# EAGLE design DummyLoad (EAGLE 8.6.3)
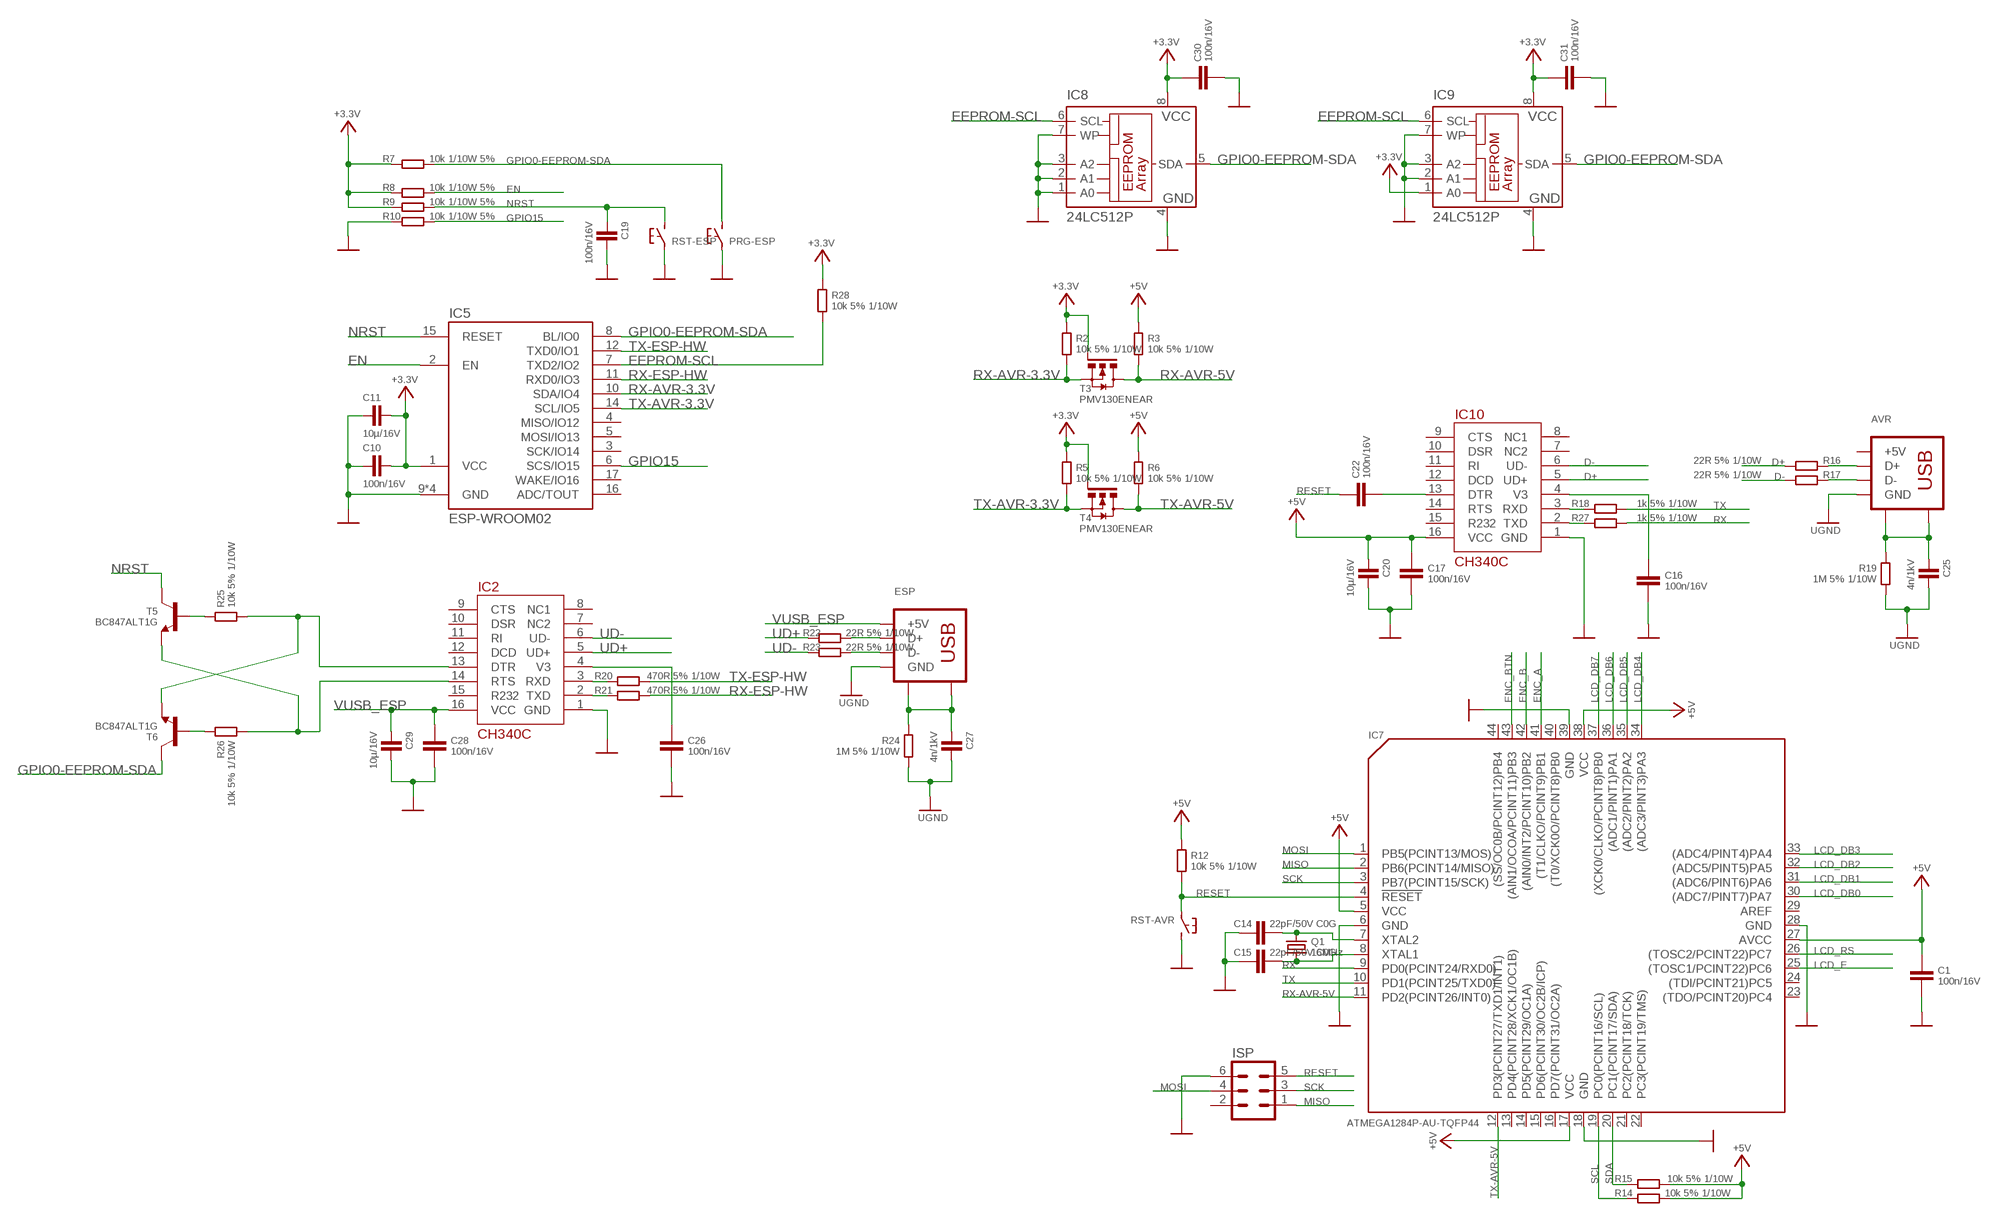
[diagram p0: schematic, sheet 1, part 1 of 2]
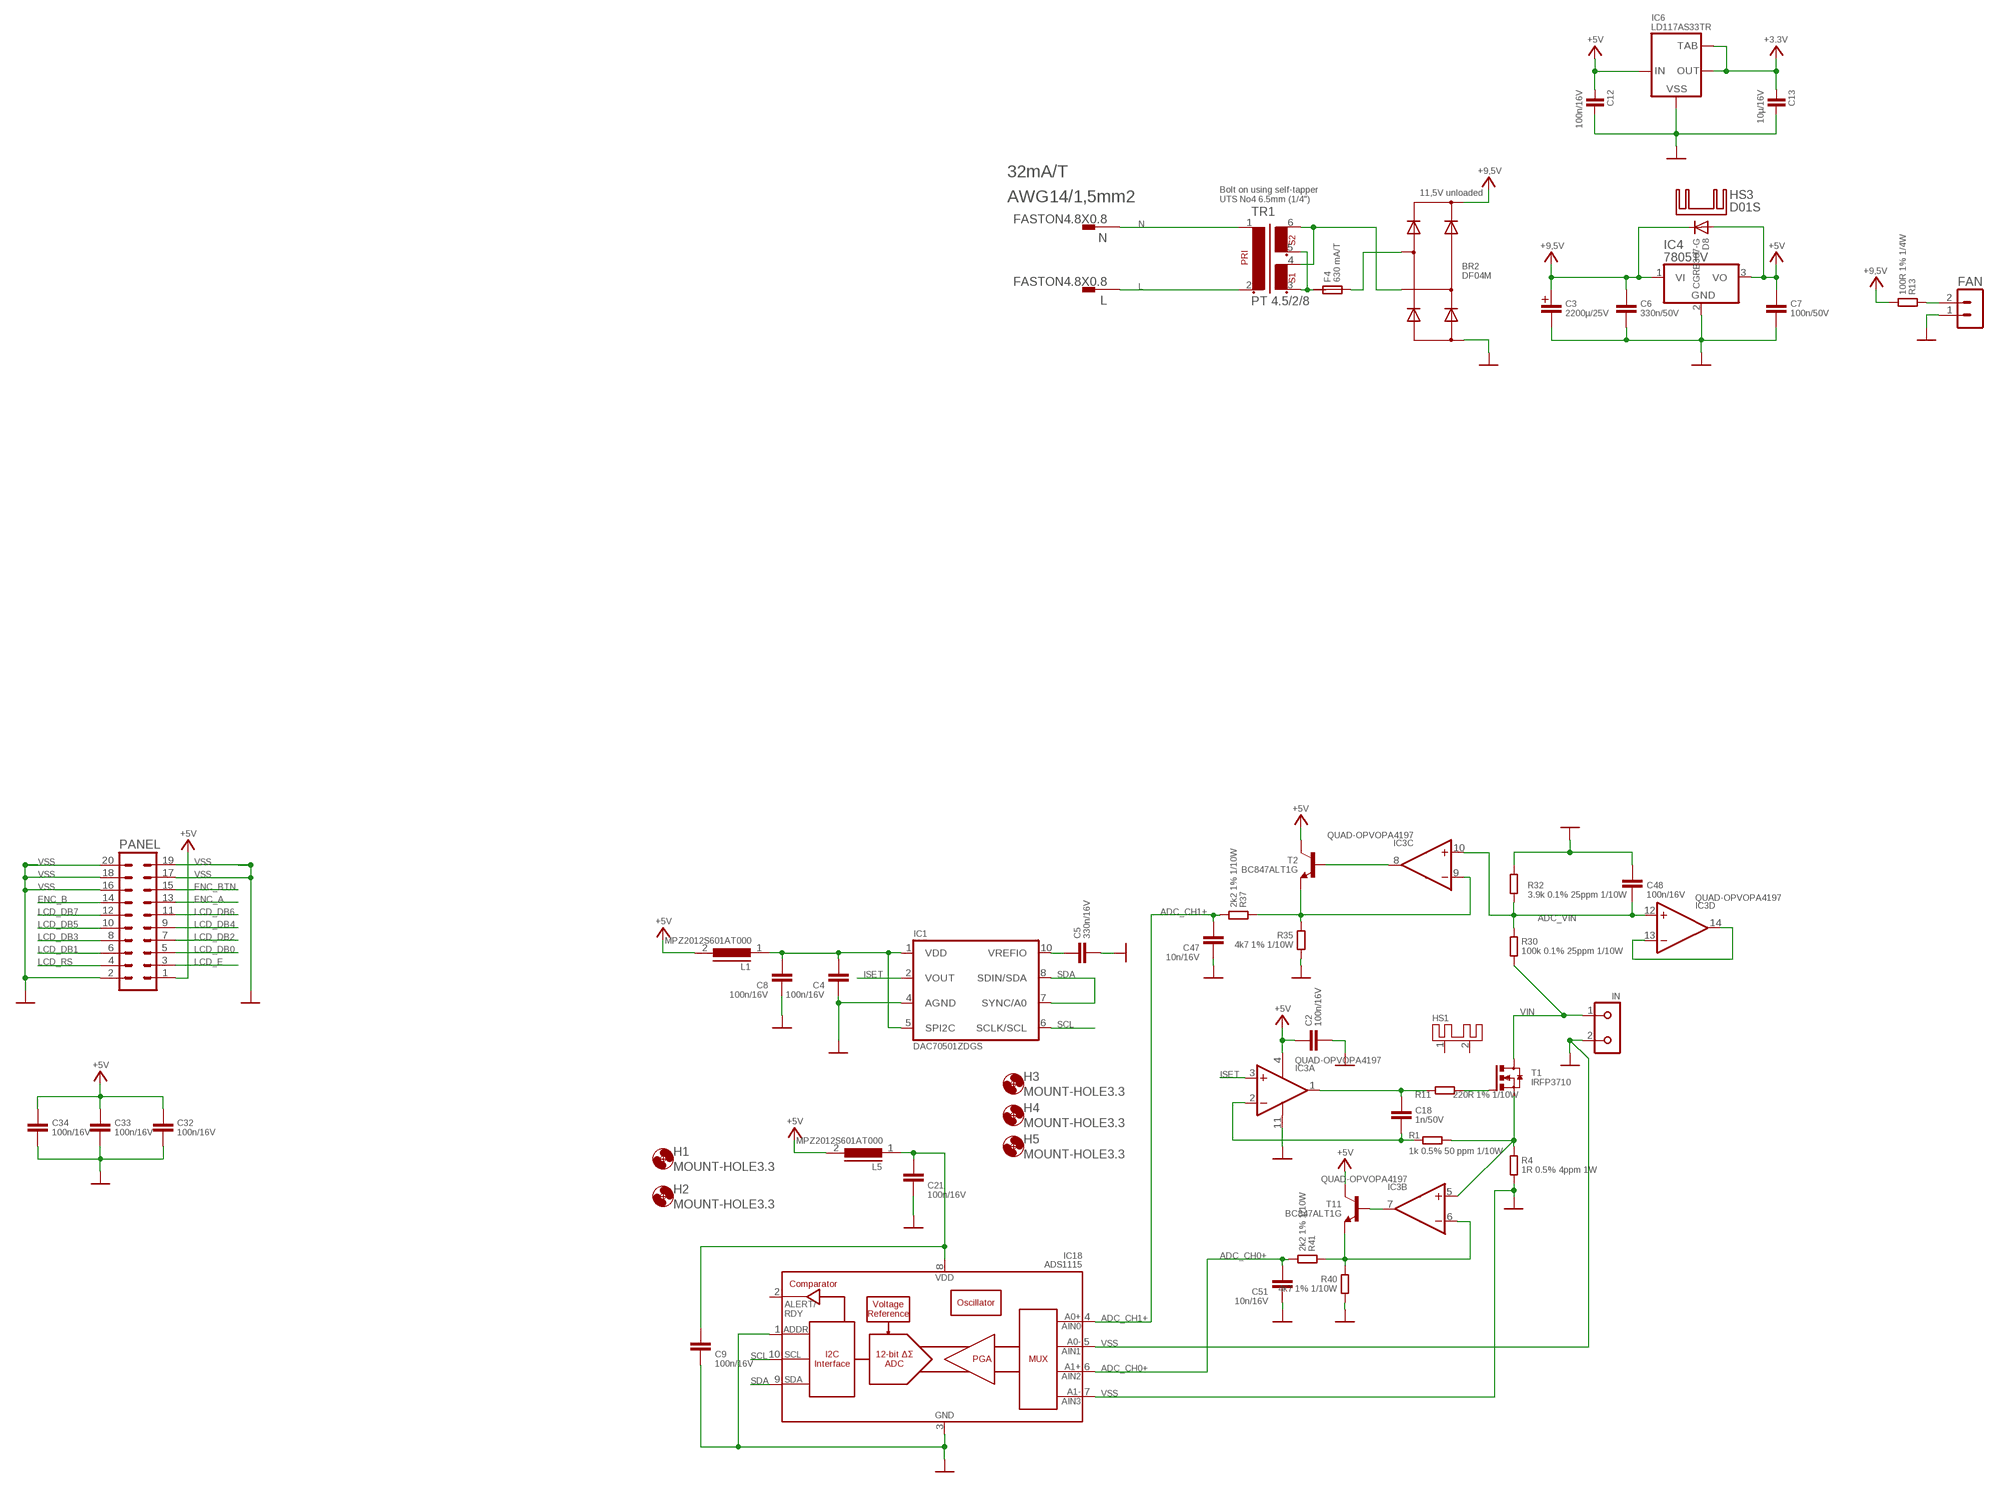
[diagram p1: schematic, sheet 1, part 2 of 2]

## Parts
AVR  USBUSB-B  [USB-B]
BR2  DF04M  BRDIL2  [BR-DIL2]
C1  100n/16V  CC/0805  [0805]
C2  100n/16V  CC/0805  [0805]
C3  2200µ/25V  C+5/12.5  [C+/5/12.5]
C4  100n/16V  CC/0805  [0805]
C5  330n/16V  CC/0805  [0805]
C6  330n/50V  CC/0805  [0805]
C7  100n/50V  CC/0805  [0805]
C8  100n/16V  CC/0805  [0805]
C9  100n/16V  CC/0805  [0805]
C10  100n/16V  CAPACITOR-0805  [C0805]
C11  10µ/16V  CAPACITOR-1210  [C1210]
C12  100n/16V  CAPACITOR-0805  [C0805]
C13  10µ/16V  CAPACITOR-1210  [C1210]
C14  22pF/50V C0G  CC/0805  [0805]
C15  22pF/50V C0G  CC/0805  [0805]
C16  100n/16V  CC/0805  [0805]
C17  100n/16V  CC/0805  [0805]
C18  1n/50V  CC/0805  [0805]
C19  100n/16V  CAPACITOR-0805  [C0805]
C20  10µ/16V  CAPACITOR-1210  [C1210]
C21  100n/16V  CC/0805  [0805]
C22  100n/16V  CC/0805  [0805]
C25  4n/1kV  CAPACITOR-1206  [C1206]
C26  100n/16V  CC/0805  [0805]
C27  4n/1kV  CAPACITOR-1206  [C1206]
C28  100n/16V  CC/0805  [0805]
C29  10µ/16V  CAPACITOR-1210  [C1210]
C30  100n/16V  CC/0805  [0805]
C31  100n/16V  CC/0805  [0805]
C32  100n/16V  CC/0805  [0805]
C33  100n/16V  CC/0805  [0805]
C34  100n/16V  CC/0805  [0805]
C47  10n/16V  CC/0805  [0805]
C48  100n/16V  CC/0805  [0805]
C51  10n/16V  CC/0805  [0805]
D8  CGRB307-G  DWIDE  [DO214AA-CGRB307-G]
ESP  USBUSB-B  [USB-B]
F4  630 mA/T  F5X20  [F5X20]
FAN  JST-PH-2.0-2P  [JST-PH-2.0-2P]
H1  MOUNT-HOLE3.3  [3,3]
H2  MOUNT-HOLE3.3  [3,3]
H3  MOUNT-HOLE3.3  [3,3]
H4  MOUNT-HOLE3.3  [3,3]
H5  MOUNT-HOLE3.3  [3,3]
HS1  HSCR201-50  [CR201-50]
HS3  D01S  [D01S]
IC1  DAC70501ZDGS  DAC70501  [VSSOP10]
IC2  CH340C  [SOP16]
IC3  QUAD-OPVOPA4197  [SO14]
IC4  7805TV  [TO220V]
IC5  ESP-WROOM02  [ESP-WROOM02]
IC6  LD117AS33TR  [SOT223]
IC7  ATMEGA1284P-AU-TQFP44  MCU-ATMEGA1284P-AU(TQFP44)  [TQFP44-0.8-9.6X9.6MM]
IC8  24LC512P  24P  [DIL08]
IC9  24LC512P  24P  [DIL08]
IC10  CH340C  [SOP16]
IC18  ADS1115  ADS1015VSSOP10  [VSSOP10]
IN  KL2691311500002  [KL2-691311500002]
ISP  ML6  [ML6]
L  FASTON4.8X0.8  [FASTON-4.8X0.8]
L1  MPZ2012S601AT000  L0805  [C0805K]
L5  MPZ2012S601AT000  L0805  [C0805K]
N  FASTON4.8X0.8  [FASTON-4.8X0.8]
PANEL  MA10-2  [MA10-2]
PRG-ESP  TS1B3F-10XX  [B3F-10XX]
Q1  16MHz  Q5X3.2MM-TXC-7A-SERIES  [Q-5X3.2MM-TXC-7A.SERIES]
R1  1k 0.5% 50 ppm 1/10W  R-SMD0805  [C0805K]
R2  10k 5% 1/10W  R-SMD0805  [C0805K]
R3  10k 5% 1/10W  R-SMD0805  [C0805K]
R4  1R 0.5% 4ppm 1W  R-SHUNTVSR  [R-SHUNT-VSR]
R5  10k 5% 1/10W  R-SMD0805  [C0805K]
R6  10k 5% 1/10W  R-SMD0805  [C0805K]
R7  10k 1/10W 5%  R-SMD0805  [C0805K]
R8  10k 1/10W 5%  R-SMD0805  [C0805K]
R9  10k 1/10W 5%  R-SMD0805  [C0805K]
R10  10k 1/10W 5%  R-SMD0805  [C0805K]
R11  220R 1% 1/10W  R-SMD0805  [C0805K]
R12  10k 5% 1/10W  R-SMD0805  [C0805K]
R13  100R 1% 1/4W  R-SMD0805  [C0805K]
R14  10k 5% 1/10W  R-SMD0805  [C0805K]
R15  10k 5% 1/10W  R-SMD0805  [C0805K]
R16  22R 5% 1/10W  R-SMD0805  [C0805K]
R17  22R 5% 1/10W  R-SMD0805  [C0805K]
R18  1k 5% 1/10W  R-SMD0805  [C0805K]
R19  1M 5% 1/10W  R-SMD0805  [C0805K]
R20  470R 5% 1/10W  R-SMD0805  [C0805K]
R21  470R 5% 1/10W  R-SMD0805  [C0805K]
R22  22R 5% 1/10W  R-SMD0805  [C0805K]
R23  22R 5% 1/10W  R-SMD0805  [C0805K]
R24  1M 5% 1/10W  R-SMD0805  [C0805K]
R25  10k 5% 1/10W  R-SMD0805  [C0805K]
R26  10k 5% 1/10W  R-SMD0805  [C0805K]
R27  1k 5% 1/10W  R-SMD0805  [C0805K]
R28  10k 5% 1/10W  R-SMD0805  [C0805K]
R30  100k 0.1% 25ppm 1/10W  R-SMD0805  [C0805K]
R32  3.9k 0.1% 25ppm 1/10W  R-SMD0805  [C0805K]
R35  4k7 1% 1/10W  R-SMD0805  [C0805K]
R37  2k2 1% 1/10W  R-SMD0805  [C0805K]
R40  4k7 1% 1/10W  R-SMD0805  [C0805K]
R41  2k2 1% 1/10W  R-SMD0805  [C0805K]
RST-AVR  TS1B3F-10XX  [B3F-10XX]
RST-ESP  TS1B3F-10XX  [B3F-10XX]
T1  IRFP3710  T-NMOSTO247  [TOP3AV]
T2  BC847ALT1G  T-NPNSOT23-BEC  [SOT23-BEC]
T3  PMV130ENEAR  T-NMOSIRLML2502PBF  [SOT23]
T4  PMV130ENEAR  T-NMOSIRLML2502PBF  [SOT23]
T5  BC847ALT1G  T-NPNSOT23-BEC  [SOT23-BEC]
T6  BC847ALT1G  T-NPNSOT23-BEC  [SOT23-BEC]
T11  BC847ALT1G  T-NPNSOT23-BEC  [SOT23-BEC]
TR1  PT 4.5/2/8  PT4,5/2/..  [PT/4,5/2/..]

## Nets
+3.3V: C10.2 C11.2 C13.1 C30.1 C31.1 IC5.1(VCC) IC6.2(OUT) IC6.4(OUT1) IC8.8(VCC) IC9.1(A0) IC9.8(VCC) R2.1 R5.1 R7.1 R8.1 R9.1 R28.1 T3.1(G) T4.1(G)
+5V: C1.1 C2.1 C7.1 C12.1 C17.1 C20.1 C32.1 C33.1 C34.1 D8.A IC3.4(PWR:V+) IC4.3(VO) IC6.3(IN) IC7.5(VCC) IC7.17(VCC) IC7.27(AVCC) IC7.38(VCC) IC10.16(VCC) L1.2 L5.2 PANEL.1 R3.1 R6.1 R12.1 R14.2 R15.2 T2.C T11.C
+9,5V: BR2.DC+ C3.+ C6.1 D8.C IC4.1(VI) R13.2
ADC_CH0+: C51.1 IC18.6(AIN2) R41.2
ADC_CH1+: C47.1 IC18.4(AIN0) R37.2
ADC_VIN: C48.2 IC3.10(C:+IN) IC3.12(D:+IN) R30.1 R32.2
D+: IC10.5(UD+) R16.1
D-: IC10.6(UD-) R17.1
EEPROM-SCL: IC5.7(TXD2/IO2) IC8.6(SCL) IC9.6(SCL) R28.2
EN: IC5.2(EN) R8.2
ENC_A: IC7.41((T1/CLKO/PCINT9)PB1) PANEL.13
ENC_B: IC7.42((AIN0/INT2/PCINT10)PB2) PANEL.14
ENC_BTN: IC7.43((AIN1/OCOA/PCINT11)PB3) PANEL.15
GPIO0-EEPROM-SDA: IC5.8(BL/IO0) IC8.5(SDA) IC9.5(SDA) PRG-ESP.3 R7.2 T6.C
GPIO15: IC5.6(SCS/IO15) R10.2
ISET: IC1.2(VOUT) IC3.3(A:+IN)
L: L.A1 L.A2 TR1.2
LCD_DB0: IC7.30((ADC7/PINT7)PA7) PANEL.5
LCD_DB1: IC7.31((ADC6/PINT6)PA6) PANEL.6
LCD_DB2: IC7.32((ADC5/PINT5)PA5) PANEL.7
LCD_DB3: IC7.33((ADC4/PINT4)PA4) PANEL.8
LCD_DB4: IC7.34((ADC3/PINT3)PA3) PANEL.9
LCD_DB5: IC7.35((ADC2/PINT2)PA2) PANEL.10
LCD_DB6: IC7.36((ADC1/PINT1)PA1) PANEL.11
LCD_DB7: IC7.37((XCK0/CLKO/PCINT8)PB0) PANEL.12
LCD_E: IC7.25((TOSC1/PCINT22)PC6) PANEL.3
LCD_RS: IC7.26((TOSC2/PCINT22)PC7) PANEL.4
MISO: IC7.2(PB6(PCINT14/MISO)) ISP.1
MOSI: IC7.1(PB5(PCINT13/MOS)) ISP.4
N: N.A1 N.A2 TR1.1
N$1: C18.1 IC3.1(A:OUT) R11.1
N$2: IC3.7(B:OUT) T11.B
N$3: C16.1 IC10.4(V3)
N$4: C18.2 IC3.2(A:-IN) R1.2
N$5: IC3.5(B:+IN) R1.1 R4.1 T1.E(S)
N$6: C9.1 C21.1 IC18.8(VDD) L5.1
N$7: C5.1 IC1.10(VREFIO)
N$8: IC3.8(C:OUT) T2.B
N$9: IC3.13(D:-IN) IC3.14(D:OUT)
N$10: AVR.D+ R16.2
N$11: AVR.D- R17.2
N$12: R11.2 T1.B(G)
N$13: IC10.3(RXD) R18.1
N$14: C14.2 IC7.7(XTAL2) Q1.2
N$15: C15.2 IC7.8(XTAL1) Q1.1
N$16: IC10.2(TXD) R27.1
N$17: AVR.SH1 AVR.SH2 C25.1 R19.1
N$18: C26.1 IC2.4(V3)
N$19: IC2.3(RXD) R20.1
N$20: IC2.2(TXD) R21.1
N$21: ESP.D+ R22.2
N$22: ESP.D- R23.2
N$23: C27.1 ESP.SH1 ESP.SH2 R24.1
N$24: R25.1 T5.B
N$25: R26.1 T6.B
N$26: C22.2 IC10.13(DTR)
N$27: BR2.AC1 F4.3 F4.4
N$28: IC2.14(RTS) R26.2 T5.E
N$29: IC2.13(DTR) R25.2 T6.E
N$33: F4.1 F4.2 TR1.3 TR1.5
N$34: BR2.AC2 TR1.4 TR1.6
N$35: FAN.2 R13.1
N$41: IC3.9(C:-IN) R35.1 R37.1 T2.E
N$45: IC3.6(B:-IN) R40.1 R41.1 T11.E
NRST: C19.1 IC5.15(RESET) R9.2 RST-ESP.3 T5.C
RESET: C22.1 IC7.4(!RESET) ISP.5 R12.2 RST-AVR.1
RX: IC7.9(PD0(PCINT24/RXD0)) R27.2
RX-AVR-3.3V: IC5.10(SDA/IO4) R2.2 T3.2(S)
RX-AVR-5V: IC7.11(PD2(PCINT26/INT0)) R3.2 T3.3(D)
RX-ESP-HW: IC5.11(RXD0/IO3) R21.2
SCK: IC7.3(PB7(PCINT15/SCK)) ISP.3
SCL: IC1.6(SCLK/SCL) IC7.19(PC0(PCINT16/SCL)) IC18.10(SCL) R14.1
SDA: IC1.7(SYNC/A0) IC1.8(SDIN/SDA) IC7.20(PC1(PCINT17/SDA)) IC18.9(SDA) R15.1
TX: IC7.10(PD1(PCINT25/TXD0)) R18.2
TX-AVR-3.3V: IC5.14(SCL/IO5) R5.2 T4.2(S)
TX-AVR-5V: IC7.12(PD3(PCINT27/TXD1/INT1)) R6.2 T4.3(D)
TX-ESP-HW: IC5.12(TXD0/IO1) R20.2
UD+: IC2.5(UD+) R22.1
UD-: IC2.6(UD-) R23.1
UGND: AVR.GND C25.2 C27.2 ESP.GND R19.2 R24.2
VDD: C4.1 C8.1 IC1.1(VDD) IC1.5(SPI2C) L1.1
VIN: IN.1 R30.2 T1.C(D)
VSS: BR2.DC- C1.2 C2.2 C3.- C4.2 C5.2 C6.2 C7.2 C8.2 C9.2 C10.1 C11.1 C12.2 C13.2 C14.1 C15.1 C16.2 C17.2 C19.2 C20.2 C21.2 C26.2 C28.2 C29.2 C30.2 C31.2 C32.2 C33.2 C34.2 C47.2 C48.1 C51.2 FAN.1 IC1.4(AGND) IC2.1(GND) IC3.11(PWR:V-) IC4.2(GND) IC5.9(GND) IC5.13(GND) IC5.18(GND) IC5.TP(GND) IC6.1(VSS) IC7.6(GND) IC7.18(GND) IC7.28(GND) IC7.39(GND) IC8.1(A0) IC8.2(A1) IC8.3(A2) IC8.4(GND) IC8.7(WP) IC9.2(A1) IC9.3(A2) IC9.4(GND) IC9.7(WP) IC10.1(GND) IC18.1(ADDR) IC18.3(VSS) IC18.5(AIN1) IC18.7(AIN3) IN.2 ISP.6 PANEL.2 PANEL.16 PANEL.17 PANEL.18 PANEL.19 PANEL.20 PRG-ESP.1 R4.2 R10.1 R32.1 R35.2 R40.2 RST-AVR.3 RST-ESP.1
VUSB_ESP: C28.1 C29.1 ESP.+5V IC2.16(VCC)
Unconnected: AVR.+5V HS1.1 HS1.2 IC2.7(NC2) IC2.8(NC1) IC2.9(CTS) IC2.10(DSR) IC2.11(RI) IC2.12(DCD) IC2.15(R232) IC5.3(SCK/IO14) IC5.4(MISO/IO12) IC5.5(MOSI/IO13) IC5.16(ADC/TOUT) IC5.17(WAKE/IO16) IC7.13(PD4(PCINT28/XCK1/OC1B)) IC7.14(PD5(PCINT29/OC1A)) IC7.15(PD6(PCINT30/OC2B/ICP)) IC7.16(PD7(PCINT31/OC2A)) IC7.21(PC2(PCINT18/TCK)) IC7.22(PC3(PCINT19/TMS)) IC7.23((TDO/PCINT20)PC4) IC7.24((TDI/PCINT21)PC5) IC7.29(AREF) IC7.40((T0/XCK0O/PCINT8)PB0) IC7.44((SS/OC0B/PCINT12)PB4) IC10.7(NC2) IC10.8(NC1) IC10.9(CTS) IC10.10(DSR) IC10.11(RI) IC10.12(DCD) IC10.14(RTS) IC10.15(R232) IC18.2(ALERT/RDY) ISP.2

## Notes on the sheet
- 32mA/T
- 11,5V unloaded
- AWG14/1,5mm2
- Bolt on using self-tapper
  UTS No4 6.5mm (1/4")

## Library data of the parts
AVR ESP = goujine-connectors:USB; OC_RS: 674-1328
BR2 = goujine:BR; OC_MOUSER: 621-DF04M; OC_MOUSER_ALT: 512-DF04M
C1 C2 C4 C7-C9 C16 C17 C21 C22 C26 C28 C30-C34 C48 = goujine:C: Kondensator; OC_MOUSER: 810-C2012X7R2A104K
C3 = neumluc:C+; OC_MOUSER: 667-EEU-FS1E222
C5 C6 = goujine:C: Kondensator; OC_MOUSER: 80-C0805C334K5RECTU
C10 C12 C19 = neumluc:CAPACITOR: Capacitors ...2.2uF @ 6.3V -> 0402 ...4.7uF @ 6.3V -> 0603 ...10uF @ 16V -> 0805 ...22uF @ 25V -> 1206; OC_MOUSER: 810-C2012X7R2A104K
C11 C13 C20 C29 = neumluc:CAPACITOR: Capacitors ...2.2uF @ 6.3V -> 0402 ...4.7uF @ 6.3V -> 0603 ...10uF @ 16V -> 0805 ...22uF @ 25V -> 1206; OC_MOUSER: 963-UMK316BBJ106KL-T
C14 C15 = goujine:C: Kondensator; OC_MOUSER: 603-CC805JRNPO9BN220
C18 = goujine:C: Kondensator; OC_MOUSER: 603-CC805KRX7R0BB102
C25 C27 = neumluc:CAPACITOR: Capacitors ...2.2uF @ 6.3V -> 0402 ...4.7uF @ 6.3V -> 0603 ...10uF @ 16V -> 0805 ...22uF @ 25V -> 1206; OC_MOUSER: 581-1206AC392K
C47 C51 = goujine:C: Kondensator; OC_MOUSER: 80-C0805C103K1R
D8 = neumluc:D; OC_MOUSER: 750-CGRB307-G
F4 = goujine:F: Sicherung; OC_MOUSER: 693-0751.0110
FAN = neumluc:JST-PH-2.0-2P: PIN HEADER; OC_DIGIKEY: 455-1704-ND; OC_MOUSER_ADD: 369-MF60251V21UA99
H1-H5 = holes:MOUNT-HOLE: MOUNTING HOLE with drill center marker
HS1 = neumluc:HS; OC_MOUSER: 588-CR201-50VE; OC_MOUSER_ADD: 588-CLA-TO-21E
HS3 = heatsink:D01S: HEATSINK distributor Schukat; OC_MOUSER: 532-576802B00
IC1 = neumluc:DAC70501; OC_MOUSER: 595-DAC70501ZDGS
IC2 IC10 = neumluc:CH340; OC_MOUSER: C84681
IC3 = neumluc:QUAD-OPV; OC_MOUSER: 595-OPA4197IDR
IC4 = linear:78*: Positive VOLTAGE REGULATOR Source: http://cache.national.com/ds/LM/LM78L05.pdf http://www.fairchildsemi.com/ds/LM/LM7805.pdf; OC_MOUSER: 511-L7805CV
IC5 = neumluc:ESP-WROOM02: Espressif ESP-WROOM-02 and AI-Thinker ESP-12 ESP8266 WiFi/WLAN Module; OC_MOUSER: 356-ESPWROOM02D(4MB)
IC6 = neumluc:LD117A?*: Low drop fixed and adjustable positive voltage regulators 1 A Source: http://www.st.com/stonline/products/literature/ds/7194/ld1117axx.pdf; OC_MOUSER: 511-LD1117AS33
IC7 = Seeed-OPL-ic:MCU-ATMEGA1284P-AU(TQFP44): 310010020; MPN: ATMEGA1284P-AU; OC_MOUSER: 556-ATMEGA1284P-AU
IC8 IC9 = neumluc:24*: Serial EEPROM I2C; OC_MOUSER: 579-24LC512-E/P
IC18 = neumluc:ADS1015: ADS1015 12-BIT ADC 12-Bit Del-Sig ADC Four single-ended inputs or two differential inputs Internal PGA I2C interface 2.0-5.5V SparkFun Products SparkFun Block for Intel Edison - ADC <https://www.sparkfun.com/products/13770> (DEV-13770); OC_MOUSER: 595-ADS1115IDGSR
IN = neumluc:KL2: Printklemme 2-polig; OC_MOUSER: 710-691311500002; OC_MOUSER_ADD: 565-72912-2; OC_MOUSER_ADD2: 565-6883
ISP = neumluc:ML6: HARTING; OC_FARNELL: unknown; OC_MOUSER: 200-TSW10307TD; OC_NEWARK: unknown
L N = neumluc:FASTON: Flachstecker Typ Tyco/Electronics/AMP TAB, FASTON Printed Circuit Board Tabs Source: http://www.buerklin.com, http://catalog.tycoelectronics.com; OC_CONRAD: 736079; OC_CONRAD_ADD: 1022092; OC_FARNELL: unknown; OC_NEWARK: unknown
L1 L5 = neumluc:L: High Power Density, High Efficiency, Shielded Inductors; OC_MOUSER: 810-MPZ2012S601AT000
PANEL = con-lstb:MA10-2: PIN HEADER; OC_FARNELL: unknown; OC_MOUSER: 649-67996-420HLF; OC_NEWARK: unknown
PRG-ESP RST-AVR RST-ESP = neumluc:TS1; OC_MOUSER: 653-B3F-1022
Q1 = neumluc:Q; OC_MOUSER: 717-7A-16.000MAAJ-T
R1 = neumluc:R-SMD: R SMD; OC_MOUSER: 754-RR1220P-102D
R2 R3 R5-R10 R12 R14 R15 R25 R26 R28 = neumluc:R-SMD: R SMD; OC_MOUSER: 652-CR0805-JW-103ELF
R4 = neumluc:R-SHUNT; OC_MOUSER: 71-VSRT1R0000DB
R11 R37 R41 = neumluc:R-SMD: R SMD; OC_MOUSER: 652-CR0805FX-2201ELF
R13 = neumluc:R-SMD: R SMD; OC_MOUSER: 660-RK73H2ATTD75R0F
R16 R17 R22 R23 = neumluc:R-SMD: R SMD; OC_MOUSER: 652-CR0805JW-220ELF
R18 R27 = neumluc:R-SMD: R SMD; OC_MOUSER: 652-CR0805FX-1001ELF
R19 R24 = neumluc:R-SMD: R SMD; OC_MOUSER: 652-CR0805JW-105ELF
R20 R21 = neumluc:R-SMD: R SMD; OC_MOUSER: 652-CR0805FX-4700ELF
R30 = neumluc:R-SMD: R SMD; OC_MOUSER: 754-RG2012P-104-B-T5
R32 = neumluc:R-SMD: R SMD; OC_MOUSER: 754-RG2012P-392-BT5
R35 R40 = neumluc:R-SMD: R SMD; OC_MOUSER: 652-CR0805FX-4701ELF
T1 = neumluc:T-NMOS: Transistor N-Channel MOSFET; OC_MOUSER: 942-IRFP3710PBF
T2 T5 T6 T11 = neumluc:T-NPN: NPN Transistor; OC_MOUSER: 863-BC847ALT1G
T3 T4 = neumluc:T-NMOS: Transistor N-Channel MOSFET; OC_MOUSER: 771-PMV130ENEAR
TR1 = neumluc:PT4,5/2/..: TRANSFORMER 1 primary winding, 1 secondary winding, mounting holes BLOCK; OC_RS: 201-8463; OC_RS_ADD: 546-5604

## Board
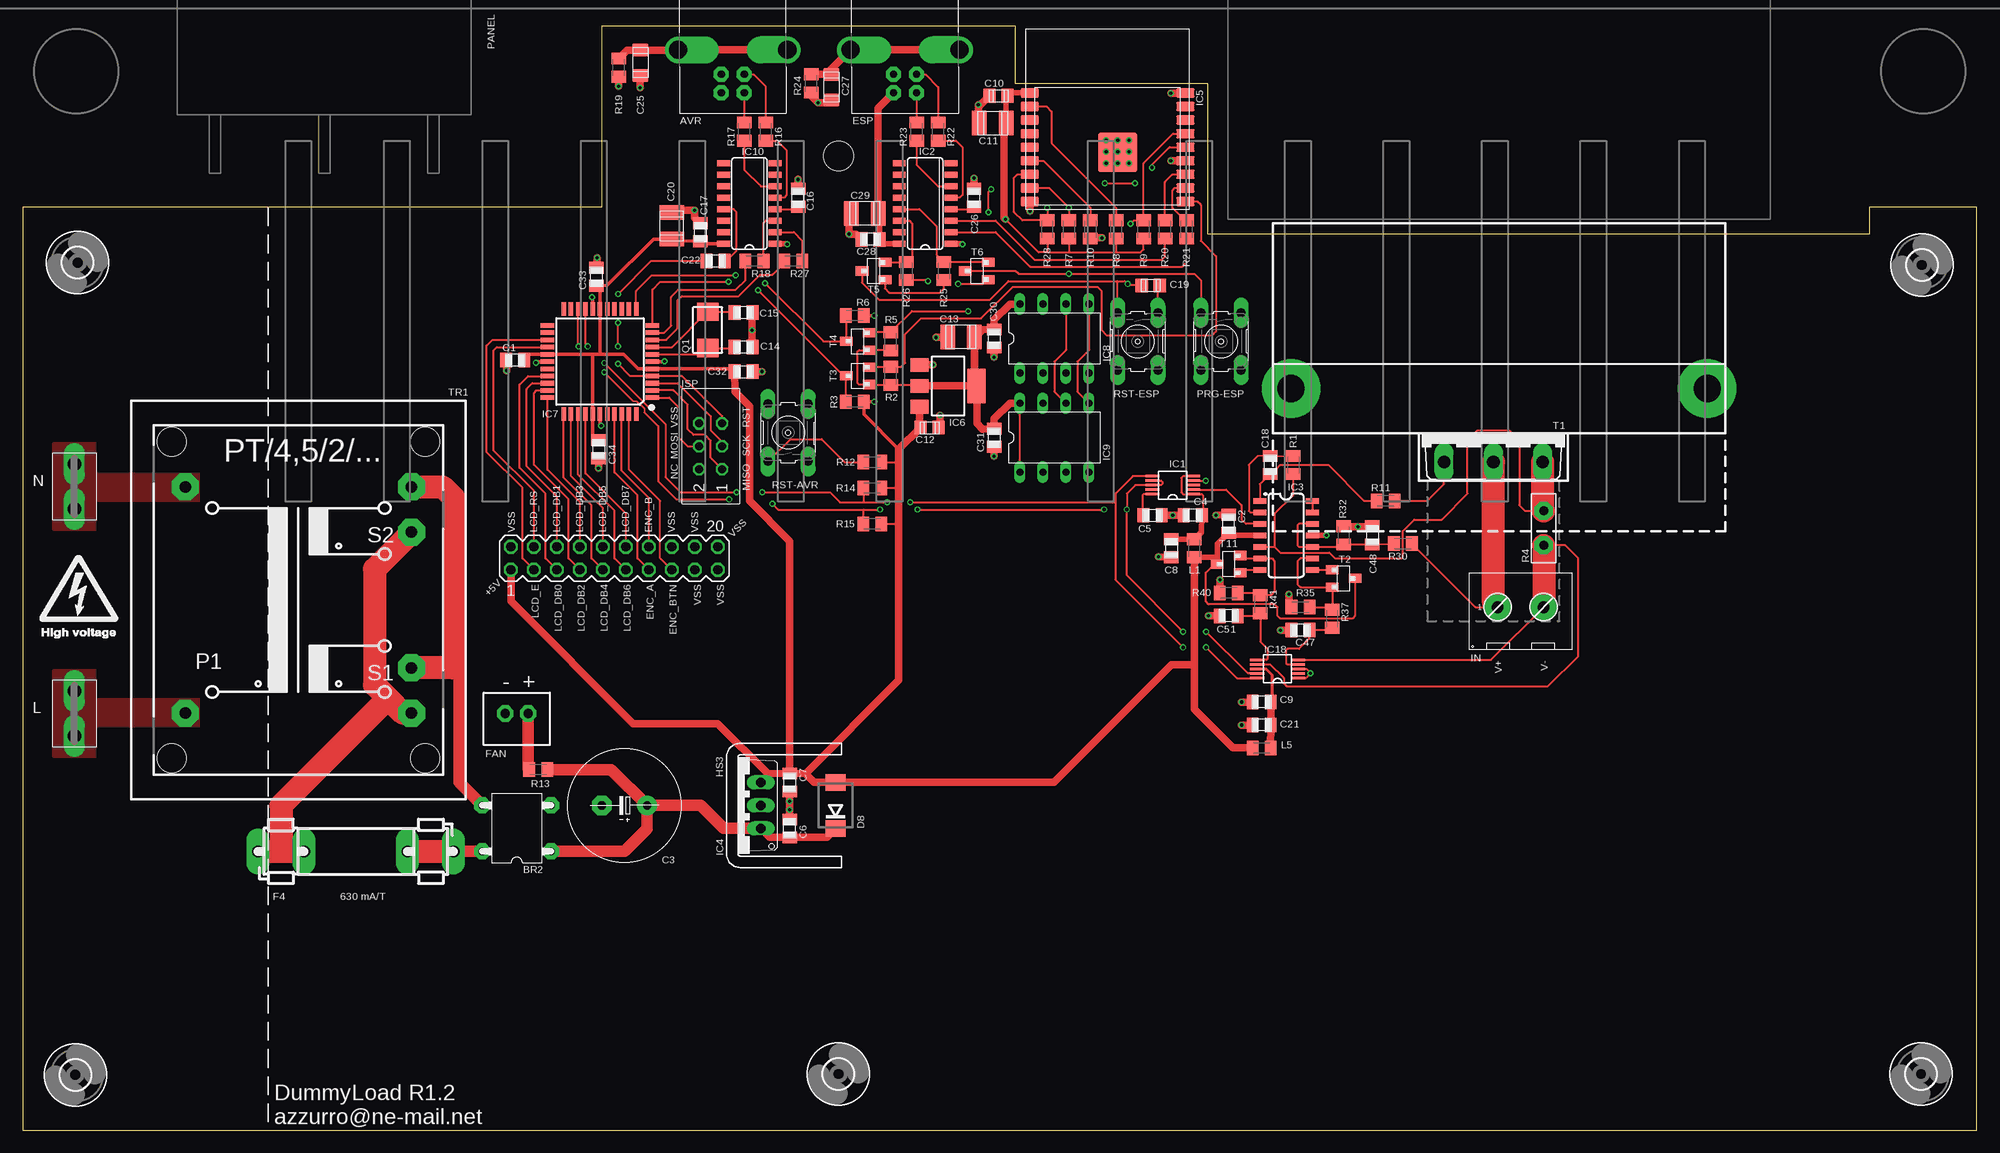
[diagram p2: board, top side]
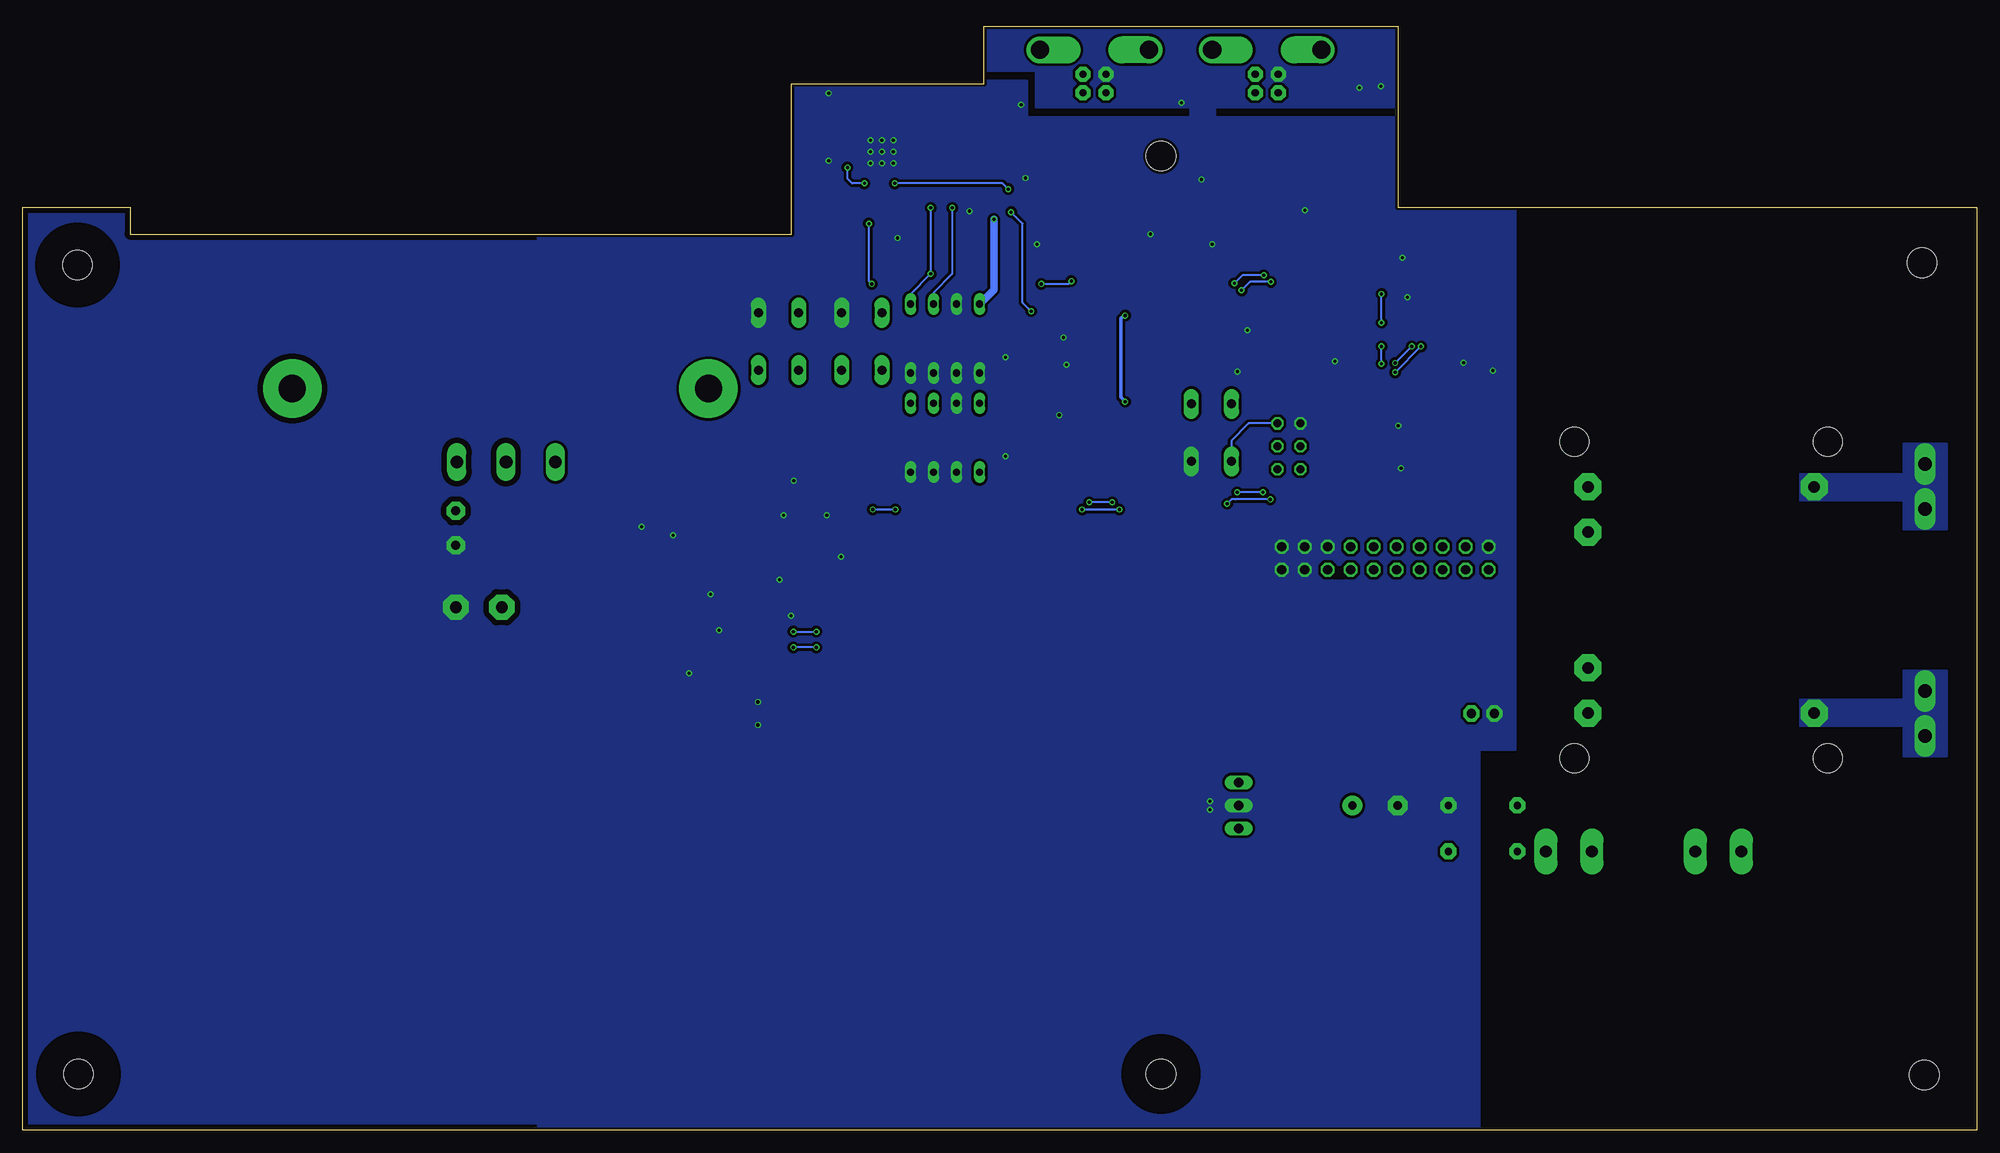
[diagram p3: board, bottom side, seen from below]

Size 216 x 122 mm. Coordinates in mm from the lower left corner, seen from the top.
Outline: 0,0 216,0 216,102 204.12,102 204.12,99 131,99 131,115.65 109.75,115.65 109.75,122 64,122 64,102 0,102 0,0
Copper layers (1*16): Top 0.035mm / dielectric 1.6mm / Bottom 0.035mm
Design rules "devnetX_JLCPCB_2-layer_PCB_eagle_rule": minimum track width 3.5mil, minimum drill 0.2mm, track to track 5mil, track to pad 5mil, pad to pad 5mil, via to via 5mil, smd to smd 0mil, copper to edge 8mil, drill to drill 10mil, minimum pad ring 3mil, minimum via ring 6mil, stop-mask expansion 0mil, vias tented up to drill 100mil, thermal gap 10mil
Holes 3.3 mm at 90.17,107.63
bRestrict: 4 lines

### Footprints (pad centres in the part's own frame; a part is rotated, then mirrored left to right if it is on the bottom)
USB-B = drill 0.8 pad 1.676 octagon: +5V 1.27,4.763; D+ -1.27,2.71; D- -1.27,4.763; GND 1.27,2.71 | drill 2 pad 2.54 offset: SH1 -6.032,0; SH2 6.032,0
BR-DIL2 = drill 0.8 pad 1.778 octagon: AC1 -2.54,3.81; AC2 2.54,3.81; DC+ -2.54,-3.81; DC- 2.54,-3.81
0805 = smd 1.3 x 1.6: 1 -1,0; 2 1,0
C+/5/12.5 = drill 0.9 pad 2.184: + -2.5,0 | drill 0.9 pad 2.184 octagon: - 2.5,0
C0805 = smd 1.5 x 1.35: 1 0,1; 2 0,-1
C1210 = smd 2.7 x 1.6: 1 0,1.475; 2 0,-1.475
C1206 = smd 1.8 x 1.45: 1 0,1.4; 2 0,-1.4
DO214AA-CGRB307-G = smd 1.8 x 2.2: A 2.55,0; C -2.55,0
F5X20 = drill 1.3 pad 2.54 long: 1 -11.43,0; 2 -6.35,0; 3 5.08,0; 4 10.16,0
JST-PH-2.0-2P = drill 1.016 pad 1.778 octagon: 1 -1.27,0; 2 1.27,0
3,3 = hole 3.3: 0,0
CR201-50 = drill 3 pad 6.452: 1 -23,-4.95; 2 23,-4.95
VSSOP10 = smd 0.3 x 1.55: 1 -1,-2.25; 2 -0.5,-2.25; 3 0,-2.25; 4 0.5,-2.25; 5 1,-2.25; 6 1,2.25; 7 0.5,2.25; 8 0,2.25; 9 -0.5,2.25; 10 -1,2.25
SOP16 = smd 0.635 x 1.422: 1 -4.445,-2.857; 2 -3.175,-2.857; 3 -1.905,-2.857; 4 -0.635,-2.857; 5 0.635,-2.857; 6 1.905,-2.857; 7 3.175,-2.857; 8 4.445,-2.857; 9 4.445,2.857; 10 3.175,2.857; 11 1.905,2.857; 12 0.635,2.857; 13 -0.635,2.857; 14 -1.905,2.857; 15 -3.175,2.857; 16 -4.445,2.857
SO14 = smd 0.6 x 1.4: 1 -3.81,-2.9; 2 -2.54,-2.9; 3 -1.27,-2.9; 4 0,-2.9; 5 1.27,-2.9; 6 2.54,-2.9; 7 3.81,-2.9; 8 3.81,2.9; 9 2.54,2.9; 10 1.27,2.9; 11 0,2.9; 12 -1.27,2.9; 13 -2.54,2.9; 14 -3.81,2.9
TO220V = drill 1.016 long: 1 -2.54,-2.54; 2 0,-2.54; 3 2.54,-2.54
ESP-WROOM02 = smd 2 x 1: 1 -8.6,1.9; 2 -8.6,0.4; 3 -8.6,-1.1; 4 -8.6,-2.6; 5 -8.6,-4.1; 6 -8.6,-5.6; 7 -8.6,-7.1; 8 -8.6,-8.6; 9 -8.6,-10.1; 10 8.6,-10.1; 11 8.6,-8.6; 12 8.6,-7.1; 13 8.6,-5.6; 14 8.6,-4.1; 15 8.6,-2.6; 16 8.6,-1.1; 17 8.6,0.4; 18 8.6,1.9 | smd 4.3 x 4.3: TP 1.12,-4.68
SOT223 = smd 1.5 x 2: 1 -2.3,-3.15; 2 0,-3.15; 3 2.3,-3.15 | smd 3.8 x 2: 4 0,3.15
TQFP44-0.8-9.6X9.6MM = smd 1.5 x 0.5: 1 -5.8,4; 2 -5.8,3.2; 3 -5.8,2.4; 4 -5.8,1.6; 5 -5.8,0.8; 6 -5.8,0; 7 -5.8,-0.8; 8 -5.8,-1.6; 9 -5.8,-2.4; 10 -5.8,-3.2; 11 -5.8,-4; 23 5.8,-4; 24 5.8,-3.2; 25 5.8,-2.4; 26 5.8,-1.6; 27 5.8,-0.8; 28 5.8,0; 29 5.8,0.8; 30 5.8,1.6; 31 5.8,2.4; 32 5.8,3.2; 33 5.8,4 | smd 0.5 x 1.5: 12 -4,-5.8; 13 -3.2,-5.8; 14 -2.4,-5.8; 15 -1.6,-5.8; 16 -0.8,-5.8; 17 0,-5.8; 18 0.8,-5.8; 19 1.6,-5.8; 20 2.4,-5.8; 21 3.2,-5.8; 22 4,-5.8; 34 4,5.8; 35 3.2,5.8; 36 2.4,5.8; 37 1.6,5.8; 38 0.8,5.8; 39 0,5.8; 40 -0.8,5.8; 41 -1.6,5.8; 42 -2.4,5.8; 43 -3.2,5.8; 44 -4,5.8
DIL08 = drill 0.8 long: 1 -3.81,-3.81; 2 -1.27,-3.81; 3 1.27,-3.81; 4 3.81,-3.81; 5 3.81,3.81; 6 1.27,3.81; 7 -1.27,3.81; 8 -3.81,3.81
KL2-691311500002 = drill 1.3 pad 2.8 octagon: 1 -2.54,0; 2 2.54,0
ML6 = drill 0.914 octagon: 1 -2.54,-1.27; 2 -2.54,1.27; 3 0,-1.27; 4 0,1.27; 5 2.54,-1.27; 6 2.54,1.27
FASTON-4.8X0.8 = drill 1.5 pad 2.3 long: A1 -2.5,0; A2 2.5,0
C0805K = smd 1.3 x 1.6: 1 -1,0; 2 1,0
MA10-2 = drill 1.016 octagon: 1 -11.43,-1.27; 2 -11.43,1.27; 3 -8.89,-1.27; 4 -8.89,1.27; 5 -6.35,-1.27; 6 -6.35,1.27; 7 -3.81,-1.27; 8 -3.81,1.27; 9 -1.27,-1.27; 10 -1.27,1.27; 11 1.27,-1.27; 12 1.27,1.27; 13 3.81,-1.27; 14 3.81,1.27; 15 6.35,-1.27; 16 6.35,1.27; 17 8.89,-1.27; 18 8.89,1.27; 19 11.43,-1.27; 20 11.43,1.27
B3F-10XX = drill 1 pad 1.676 long: 1 -3.175,1.905; 2 3.175,1.905; 3 -3.175,-2.54; 4 3.175,-2.54
Q-5X3.2MM-TXC-7A.SERIES = smd 2 x 2.4: 1 -2,0; 2 2,0
R-SHUNT-VSR = drill 1 pad 2 octagon: 1 -1.905,0; 2 1.905,0
TOP3AV = drill 1.397 long: B -5.461,-3.175; C 0,-3.175; E 5.461,-3.175
SOT23-BEC = smd 1 x 1.4: B -0.953,-1.27; C 0,1.27; E 0.953,-1.27
SOT23 = smd 1 x 1.4: 1 -0.953,-1.27; 2 0.953,-1.27; 3 0,1.27
PT/4,5/2/.. = drill 1.27 pad 3 octagon: 1 -12.5,12.5; 2 -12.5,-12.5; 3 12.5,-12.5; 4 12.5,-7.5; 5 12.5,7.5; 6 12.5,12.5 | hole 3.2: -14,17.5; -14,-17.5; 14,-17.5; 14,17.5

### Placement (x,y rotation side)
AVR  78.48,119.38 180 top
BR2  54.61,33.34 90 top
C1  54.45,85.09 180 top
C2  133.31,66.99 90 top
C3  66.52,35.88 180 top
C4  129.34,67.94 180 top
C5  124.89,67.94 0 top
C6  84.77,33.34 90 top
C7  84.77,38.42 270 top
C8  126.96,64.29 270 top
C9  136.96,47.31 180 top
C10  107.85,114.3 90 top
C11  107.22,111.28 90 top
C12  100.23,77.63 90 top
C13  103.73,87.63 270 top
C14  79.69,86.52 180 top
C15  79.69,90.33 180 top
C16  85.72,103.03 90 top
C17  74.93,99.22 90 top
C18  137.91,73.5 90 top
C19  124.68,93.34 90 top
C20  71.75,99.93 180 top
C21  136.96,44.77 180 top
C22  76.6,96.04 0 top
C25  68.26,117.95 0 top
C26  105.16,103.03 90 top
C27  89.38,115.25 0 top
C28  93.72,98.42 180 top
C29  93.09,101.28 270 top
C30  107.38,87.47 270 top
C31  107.38,76.52 270 top
C32  79.69,83.82 0 top
C33  63.42,94.3 90 top
C34  63.66,75.25 270 top
C47  141.24,55.24 180 top
C48  149.18,65.72 270 top
C51  133.31,56.83 180 top
D8  89.85,35.88 90 top
ESP  97.53,119.38 180 top
F4  37.46,30.8 0 top
FAN  54.61,46.04 0 top
H1  6.08,95.85 0 top
H2  5.83,6.1 0 top
H3  90.17,6.2 0 top
H4  209.82,6.2 0 top
H5  209.93,95.6 0 top
HS1  163.19,76.99 180 top
HS3  79.06,35.88 270 top
IC1  127.11,71.28 90 top
IC2  99.76,102.39 90 top
IC3  139.66,65.72 270 top
IC4  79.06,35.88 90 top
IC5  119.92,112.71 0 top
IC6  102.3,82.23 270 top
IC7  63.82,84.93 180 top
IC8  114.05,87.47 0 top
IC9  114.05,76.52 0 top
IC10  80.33,102.39 90 top
IC18  138.7,50.96 90 top
IN  165.58,57.78 0 top
ISP  76.04,75.57 90 top
L  5.71,46.04 90 top
L1  129.5,64.29 270 top
L5  136.96,42.23 180 top
N  5.71,71.12 90 top
PANEL  65.41,63.18 0 top
PRG-ESP  132.78,87.15 270 top
Q1  75.72,88.42 270 top
R1  140.45,73.5 90 top
R2  95.95,83.34 90 top
R3  91.98,80.49 180 top
R4  168.12,66.52 270 top
R5  95.95,87.15 90 top
R6  91.98,90.01 180 top
R7  115.63,99.54 90 top
R8  120.87,99.54 90 top
R9  123.89,99.54 90 top
R10  118.01,99.54 90 top
R11  150.65,69.53 0 top
R12  93.92,73.82 180 top
R13  56.99,39.85 0 top
R14  93.92,70.96 0 top
R15  93.92,66.99 0 top
R16  82.14,110.33 90 top
R17  79.75,110.33 90 top
R18  80.88,96.04 180 top
R19  65.88,117.41 270 top
R20  126.27,99.54 90 top
R21  128.65,99.54 90 top
R22  101.19,110.33 90 top
R23  98.81,110.33 90 top
R24  87.15,115.67 270 top
R25  101.82,94.93 90 top
R26  97.69,94.93 90 top
R27  85.17,96.04 180 top
R28  113.25,99.54 90 top
R30  152.56,64.81 0 top
R32  146.01,65.72 270 top
R35  141.24,57.78 180 top
R37  144.74,56.52 270 top
R40  133.31,59.37 180 top
R41  136.8,58.1 270 top
RST-AVR  84.3,77.07 90 top
RST-ESP  123.57,87.15 270 top
T1  162.56,76.99 0 top
T2  146.01,60.96 270 top
T3  92.3,83.34 90 top
T4  92.3,87.15 90 top
T5  94.04,94.93 90 top
T6  105.47,94.93 90 top
T11  133.31,62.55 90 top
TR1  30.48,58.58 0 top
U$1  [CASE-Z17]  108,26 0 top
U$2  [IEC-C14-FUSED-6200.2200]  33.34,129.18 0 top  (outside the outline)
U$3  [FAN60X25]  163.19,113.14 0 top
U$4  [SWITCH-ROCKER-1858.1103]  22.54,-77.36 180 top  (outside the outline)

### Tracks (layer width: path | path; a pad name or v marks a point on that pad's centre or on a via)
+3.3V  (via drill 0.35)
  Top 0.203: 113.25,97 112.3,97 v108.65,100.65 | 113.25,97 115.63,97 | 115.63,97 120.87,97 | 120.87,97 123.57,97 123.89,97.31 R9.1 | R28.1 113.25,97 | R7.1 115.63,97 | R8.1 120.87,97 | IC9.1 IC9.8 | R5.1 93.61,86.15 T4.1 92.45,86.2 92.3,86.04 92.3,82.55 92.45,82.39 T3.1 95.9,82.39 R2.1 99.04,82.34 IC6.2 | 104.95,82.23 105.2,82.48 | C13.1 105.36,87.79 105.47,87.79
  Top 0.61: IC5.1 109.17,114.61 C10.2 108.69,114.14 C11.2
  Top 0.813: v108.65,100.65 108.49,100.81 108.49,111.08 C11.2 | IC8.8 109.12,91.28 107.38,89.53 C30.1 106.11,88.42 105.47,87.79 | IC9.8 109.12,80.33 107.38,78.58 C31.1 106.11,77.47 105.47,78.11 105.47,82.21 IC6.4 | C13.1 105.2,82.48 IC6.4 | IC6.2 IC6.4
  Bottom 0.813: IC8.8 108.65,92.87 v108.65,100.65
+5V  (via drill 0.35)
  Top 0.203: 133.58,65.72 C2.1 | T2.C 147.28,56.83 146.96,56.52 139.02,56.52 138.7,56.83 138.7,57.78 138.39,58.1 131.08,58.1 130.77,58.42 130.77,61.59 131.72,62.55 T11.C | 92.87,80.38 R3.1 | C33.1 63.82,92.95 | R14.2 96.84,70.96 | R15.2 96.84,66.99 | R12.1 96.84,73.82
  Top 0.406: 63.82,92.95 IC7.17 63.82,85.73 | 63.02,85.73 IC7.27 56.05,85.73 C1.1 | 63.02,85.73 63.82,85.73 | 63.82,85.73 66.43,85.73 68.03,84.13 IC7.5 78.43,84.13 C32.1 | 63.02,85.73 63.02,85.72 IC7.38 63.02,76.84 C34.1 | 96.84,75.23 92.98,79.09 R3.1 v94.14,80.49 | IC10.16 75.25,97.95 C17.1 71.95,98.27 C20.1 69.72,98.46 64.61,93.34 C33.1 | v94.14,90.01 R6.1
  Top 0.61: IC3.4 133.58,65.72 | C2.1 132.04,64.77 132.04,63.34 | 132.04,63.34 T11.C | L1.2 131.99,63.29 132.04,63.34
  Top 0.813: L1.2 129.5,51.44 | 129.5,51.44 129.5,46.51 133.78,42.23 L5.2 | IC6.3 99.15,77.72 C12.1 96.84,75.23 96.84,73.82 96.84,70.96 96.84,66.99 96.84,49.69 86.52,39.37 | 129.5,51.44 127,51.44 113.99,38.43 D8.A 87.46,38.43 86.52,39.37 | IC4.3 82.55,39.37 | 82.55,39.37 C7.1 | C7.1 86.52,39.37 | PANEL.1 53.98,58.42 67.47,44.93 76.83,44.93 82.39,39.37 82.55,39.37 | C32.1 78.74,81.6 80.33,80.01 80.33,69.53 84.77,65.09 C7.1
  Bottom 0.406: v94.14,80.49 94.61,80.96 94.61,89.69 94.3,90.01 v94.14,90.01
+9,5V
  Top 0.813: IC4.1 82.55,32.38 C6.1 88.91,32.38 D8.C
  Top 1.27: BR2.DC+ 66.52,30.8 69.02,33.3 C3.+ | R13.2 65.05,39.85 C3.+ | C3.+ 74.93,35.88 77.47,33.34 IC4.1
ADC_CH0+
  Top 0.203: C51.1 136.53,56.83 R41.2 136.8,53.98 137.59,53.18 137.59,52.07 137.48,51.96 IC18.6
ADC_CH1+
  Top 0.203: IC18.4 139.79,51.46 139.66,51.59 139.66,53.02 139.81,53.18 141.09,53.18 142.2,54.29 C47.1 144.47,55.24 R37.2
ADC_VIN
  Top 0.203: IC3.12 141.09,66.99 140.93,66.83 140.93,64.61 141.09,64.45 IC3.10 145.74,64.45 R32.2 C48.2 151.51,64.77 R30.1
D+
  Top 0.203: R16.1 83.39,109.33 84.45,108.27 84.45,103.35 84.14,103.03 IC10.5
D-
  Top 0.203: R17.1 79.75,106.14 81.6,104.3 IC10.6
EEPROM-SCL  (via drill 0.35)
  Top 0.203: v113.25,101.92 R28.2 110.5,100.54 109.6,101.44 109.6,105.25 109.96,105.61 IC5.7 | IC8.6 115.31,86.2 114.05,84.93 114.05,81.6 IC9.6
  Bottom 0.203: v113.25,101.92 113.25,94.61 115.31,92.55 IC8.6
EN
  Top 0.203: IC5.2 113.17,113.11 113.73,112.55 113.73,109.06 120.87,101.92 R8.2
ENC_A
  Top 0.203: PANEL.13 67.94,63.18 67.94,70.17 65.42,72.69 IC7.41
ENC_B
  Top 0.203: PANEL.14 69.22,69.85 66.22,72.85 IC7.42
ENC_BTN
  Top 0.203: PANEL.15 70.48,63.18 70.48,69.53 67.02,73 IC7.43
GPIO0-EEPROM-SDA  (via drill 0.35)
  Top 0.203: T6.C 109.76,94.93 110.08,94.61 v115.63,94.61 129.54,94.61 130.24,93.92 PRG-ESP.3 | IC5.8 113.44,104.11 v115.63,101.92 R7.2 | IC8.5 117.86,86.2 116.58,84.93 116.58,81.6 IC9.5
  Bottom 0.203: v115.63,101.92 v115.63,94.61 117.86,92.39 IC8.5
GPIO15
  Top 0.203: IC5.6 112.82,107.11 118.01,101.92 R10.2
ISET
  Top 0.203: IC3.3 135.21,66.99 134.74,67.47 134.74,69.06 133.01,70.78 IC1.2
L
  pour Top (isolate 0.305, no thermals): 19.53,44.61 19.53,47.62 8.1,47.62 8.1,50.8 3.33,50.8 3.33,41.27 8.1,41.27 8.1,44.61
  pour Bottom (isolate 0.305, no thermals): 19.53,44.61 19.53,47.62 8.1,47.62 8.1,50.8 3.33,50.8 3.33,41.27 8.1,41.27 8.1,44.61
LCD_DB0
  Top 0.203: PANEL.5 57.78,63.18 57.78,70.33 54.93,73.18 54.93,82.39 55.87,83.33 IC7.30
LCD_DB1
  Top 0.203: PANEL.6 59.05,70.01 55.72,73.34 55.72,81.92 56.34,82.53 IC7.31
LCD_DB2
  Top 0.203: PANEL.7 60.33,63.18 60.33,69.69 56.52,73.5 56.52,81.44 56.81,81.73 IC7.32
LCD_DB3
  Top 0.203: PANEL.8 61.59,69.37 58.02,72.95 IC7.33
LCD_DB4
  Top 0.203: PANEL.9 62.87,63.18 62.87,69.06 59.82,72.1 IC7.34
LCD_DB5
  Top 0.203: PANEL.10 64.14,68.74 60.62,72.26 IC7.35
LCD_DB6
  Top 0.203: PANEL.11 65.41,63.18 65.41,68.42 61.42,72.41 IC7.36
LCD_DB7
  Top 0.203: PANEL.12 66.67,68.1 62.22,72.56 IC7.37
LCD_E
  Top 0.203: PANEL.3 55.24,63.18 55.24,70.96 51.28,74.93 51.28,86.68 51.93,87.33 IC7.25
LCD_RS
  Top 0.203: PANEL.4 56.52,70.64 52.07,75.09 52.07,86.2 52.4,86.53 IC7.26
MISO
  Top 0.203: ISP.1 76.04,74.3 76.04,76.2 75.41,76.83 74.14,76.83 73.5,77.47 73.5,80.17 71.94,81.73 IC7.2
MOSI
  Top 0.203: IC7.1 71.47,80.93 72.55,79.85 72.55,76.52 73.5,75.56 ISP.4
N
  pour Top (isolate 0.305, no thermals): 19.53,69.53 19.53,72.55 8.1,72.55 8.1,75.88 3.33,75.88 3.33,66.36 8.1,66.36 8.1,69.53
  pour Bottom (isolate 0.305, no thermals): 19.53,69.53 19.53,72.55 8.1,72.55 8.1,75.88 3.33,75.88 3.33,66.36 8.1,66.36 8.1,69.53
N$1
  Top 0.203: 137.12,69.53 IC3.1 136.76,71.39 C18.1 138.07,72.55 139.02,73.5 144.3,73.5 148.27,69.53 R11.1
N$2
  Top 0.203: T11.B 134.89,61.91 IC3.7
N$3
  Top 0.203: IC10.4 85.41,101.76 C16.1
N$4
  Top 0.203: R1.2 140.4,74.45 C18.2 136.48,74.45 135.53,73.5 135.53,68.42 135.69,68.26 IC3.2
N$5
  Top 0.203: IC3.5 138.39,64.45 | 138.39,64.45 139.02,63.82 144.42,63.82 145.05,63.18 152.4,63.18 152.56,63.34 152.56,66.2 153.83,67.47 156.84,67.47 159.7,70.33 159.7,76.2 160.81,77.31 164.31,77.31 165.42,76.2 165.42,69.06 166.05,68.42 R4.1 | 138.39,64.45 138.39,68.1 140.45,70.17 R1.1
  Top 2.54: R4.1 168.02,68.52 T1.E
N$6
  Top 0.305: IC18.8 137.43,50.96 138.07,50.32 138.07,47.47 C9.1
  Top 0.813: C9.1 C21.1 137.91,42.27 L5.1
N$7
  Top 0.203: IC1.10 123.89,70.28 123.78,70.17 123.78,68.1 C5.1
N$8
  Top 0.203: IC3.8 T2.B
N$9
  Top 0.203: IC3.14 IC3.13
N$10
  Top 0.203: AVR.D+ 80.81,116.67 82.14,115.35 R16.2
N$11
  Top 0.203: AVR.D- R17.2
N$12
  Top 0.203: R11.2 155.26,69.53 157.1,71.37 T1.B
N$13
  Top 0.203: R18.1 81.88,100.22 82.15,100.49 IC10.3
N$14
  Top 0.203: IC7.7 75.03,85.73 Q1.2 78.64,86.42 C14.2
N$15
  Top 0.203: IC7.8 71.77,86.53 75.66,90.42 Q1.1 78.64,90.42 C15.2
N$16
  Top 0.203: IC10.2 85.25,99.22 86.17,98.3 R27.1
N$17
  Top 0.813: 65.93,118.36 R19.1 66.82,119.35 C25.1 72.42,119.35 AVR.SH2 AVR.SH1
N$18
  Top 0.203: C26.1 104.84,101.76 IC2.4
N$19
  Top 0.203: IC2.3 107.54,100.49 111.82,96.2 125.95,96.2 126.27,96.52 R20.1
N$20
  Top 0.203: IC2.2 107.54,99.22 111.35,95.41 128.17,95.41 128.65,95.89 R21.1
N$21
  Top 0.203: ESP.D+ 99.77,116.67 101.19,115.25 R22.2
N$22
  Top 0.203: ESP.D- R23.2
N$23
  Top 0.813: 90.87,119.38 ESP.SH2 | ESP.SH2 ESP.SH1 | ESP.SH2 89.38,117.25 C27.1 89.36,116.67 R24.1
N$24
  Top 0.203: T5.B 95.31,93.03 95.79,92.55 101.34,92.55 101.82,93.03 R25.1
N$25  (via drill 0.35)
  Top 0.203: v100.08,93.82 99.96,93.93 R26.1 | v103.41,93.5 106.11,93.5 106.58,93.98 T6.B
  Bottom 0.203: v103.41,93.5 100.39,93.5 v100.08,93.82
N$26
  Top 0.203: IC10.13 78.58,101.76 78.9,101.44 78.9,97.16 77.79,96.04 C22.2
N$27
  Top 1.27: F4.4 BR2.AC1
  Top 2.54: F4.3 F4.4
N$28
  Top 0.203: IC2.14 98.01,100.49 98.33,100.17 98.33,96.57 R26.2 97.65,95.89 T5.E
N$29
  Top 0.203: IC2.13 99.12,101.76 101.03,99.85 101.03,96.73 R25.2 106.69,95.93 T6.E
N$33
  Top 2.54: TR1.5 38.89,61.99 38.89,49.21 40.4,47.7 | TR1.3 42.03,46.08 40.4,47.7 | F4.1 28.57,30.8 | 28.57,30.8 F4.2 | 40.4,47.7 28.57,35.88 28.57,30.8
N$34
  Top 1.27: BR2.AC2 48.26,38.42 48.26,50.41 47.59,51.08
  Top 2.54: TR1.6 46.4,71.08 47.78,69.69 47.78,51.28 47.59,51.08 TR1.4
N$35
  Top 1.27: R13.1 55.88,39.96 FAN.2
N$41
  Top 0.203: IC3.9 141.24,63.18 140.93,62.87 140.93,60.33 141.24,60.01 T2.E 144.76,59.98 144.76,57.81 | 144.78,57.78 144.76,57.81 | 144.76,57.81 R37.1 | R35.1 144.74,57.78 144.76,57.81
N$45
  Top 0.203: T11.E 134.89,63.18 IC3.6 138.07,63.18 138.39,62.87 138.39,59.53 137.96,59.1 R41.1 136.53,59.37 R40.1
NRST  (via drill 0.35)
  Top 0.203: T5.C 92.77,93.66 94.68,91.76 106.9,91.76 108.97,93.82 120.97,93.82 | IC5.15 127.16,110.11 123.89,106.84 R9.2 122.82,100.54 v122.46,100.17 | 120.97,93.82 121.82,93.82 v122.14,93.5 122.3,93.34 C19.1 | RST-ESP.3 121.03,93.76 120.97,93.82
  Bottom 0.203: v122.14,93.5 122.46,93.82 v122.46,100.17
RESET  (via drill 0.35)
  Top 0.203: ISP.5 77.31,78.9 72.88,83.33 IC7.4 67.16,83.33 v65.8,84.69 | RST-AVR.1 84.85,76.36 88.31,76.36 90.85,73.82 R12.2 | v65.8,86.6 v65.8,89.22 | v65.8,92.39 69.45,96.04 C22.1
  Bottom 0.203: v65.8,84.69 v65.8,86.6 | v65.8,89.22 v65.8,92.39 | ISP.5 80.49,78.11 82.39,76.2 RST-AVR.1
RX
  Top 0.203: IC7.9 71.14,87.33 72.39,88.58 72.39,91.68 72.87,92.15 79.14,92.15 81.52,94.54 82.87,94.54 84.14,95.81 84.14,96.01 R27.2
RX-AVR-3.3V
  Top 0.203: T3.2 93.61,84.34 R2.2 97.11,84.34 97.53,84.77 97.53,87.95 99.28,89.69 105.95,89.69 109.44,93.19 118.81,93.19 119.22,92.77 119.22,88.42 119.86,87.79 131.44,87.79 131.92,88.27 131.92,96.58 130.24,98.27 130.24,102.23 129.86,102.61 IC5.10
RX-AVR-5V  (via drill 0.35)
  Top 0.203: R3.2 91.03,80.53 T3.3 | 90.71,83.34 T3.3 | IC7.11 69.62,92.87 70.48,93.74 v78.03,93.74 | v81.28,92.79 90.73,83.34 T3.3
  Bottom 0.203: v78.03,93.74 80.33,93.74 v81.28,92.79
RX-ESP-HW
  Top 0.203: R21.2 128.44,100.54 127.06,101.92 127.06,103.82 127.35,104.11 IC5.11
SCK
  Top 0.203: IC7.3 72.41,82.53 76.04,78.9 76.04,77.31 77.31,76.04 ISP.3
SCL  (via drill 0.35)
  Top 0.152: 69.29,79.77 68.02,81.04
  Top 0.203: IC1.6 122.72,72.28 120.77,70.33 120.77,69.37 | 120.77,69.37 120.77,60.84 v128.27,53.34 | v130.81,53.34 134.19,49.96 IC18.10 | 92.95,69.37 90.33,69.37 89.22,70.48 v81.76,70.48 | 69.29,79.77 71.04,78.03 71.04,72.15 72.71,70.48 v78.9,70.48 | 68.02,81.04 v64.29,84.77 | v62.47,86.6 62.22,86.85 IC7.19 | R14.1 92.92,69.4 92.95,69.37 | 92.95,69.37 v95.57,69.37 | v98.11,69.37 120.77,69.37
  Bottom 0.203: v128.27,53.34 v130.81,53.34 | v64.29,84.77 v62.47,86.6 | v95.57,69.37 v98.11,69.37 | v78.9,70.48 v81.76,70.48
SDA  (via drill 0.35)
  Top 0.152: 67.47,80.57 67.87,80.57 68.74,79.69 68.74,79.3
  Top 0.203: IC1.7 125.82,71.78 126,71.6 126,71.44 125.84,71.28 IC1.8 122.99,71.28 122.03,70.33 v122.03,68.58 122.03,61.32 v128.27,55.09 | 136.53,50.48 IC18.9 135.44,50.46 v130.81,55.09 | 68.74,79.3 70.25,77.79 70.25,71.68 72.23,69.69 v78.11,69.69 | 67.47,80.57 v64.29,83.74 | v61.44,86.6 61.42,86.62 IC7.20 | R15.1 92.92,68.55 92.95,68.58 | 92.95,68.58 v94.77,68.58 | v98.9,68.58 v119.54,68.58 | v82.87,69.22 83.5,68.58 92.95,68.58
  Bottom 0.203: v119.54,68.58 v122.03,68.58 | v130.81,55.09 v128.27,55.09 | v64.29,83.74 v61.44,86.6 | v94.77,68.58 v98.9,68.58 | v78.11,69.69 81.92,69.69 82.39,69.69 v82.87,69.22
TX
  Top 0.203: IC7.10 70.91,88.13 71.68,88.9 71.68,92.08 72.47,92.87 78.82,92.87 79.88,93.93 R18.2
TX-AVR-3.3V  (via drill 0.35)
  Top 0.203: T4.2 93.61,88.15 R5.2 98.28,90.49 v104.52,90.49 | v106.74,101.44 106.74,103.66 v107.06,103.98 | IC5.14 126.77,108.61 124.84,106.68 v124.84,106.36 | v119.6,104.62 v122.95,104.62
  Bottom 0.203: v104.52,90.49 105.47,91.44 105.47,100.17 v106.74,101.44 | v107.06,103.98 107.69,104.62 v119.6,104.62 | v122.95,104.62 124.3,104.62 124.84,105.16 v124.84,106.36
TX-AVR-5V  (via drill 0.35)
  Top 0.203: 90.98,90.22 R6.2 91.03,89.96 T4.3 88.5,87.15 v82.07,93.58 | IC7.12 67.82,92.74 69.53,94.46 v78.82,94.46
  Bottom 0.203: v78.82,94.46 81.2,94.46 v82.07,93.58
TX-ESP-HW
  Top 0.203: R20.2 126.27,104.78 127.11,105.61 IC5.12
UD+
  Top 0.203: R22.1 103.14,109.33 103.89,108.58 103.89,103.35 103.57,103.03 IC2.5
UD-
  Top 0.203: R23.1 98.81,106.68 101.19,104.3 IC2.6
UGND  (via drill 0.35)
  Top 0.813: v65.88,115.35 R19.2 | C25.2 v68.26,115.19 | R24.2 87.15,114.32 v87.93,113.54 89.07,113.54 C27.2
  pour Bottom (isolate 0.305, no thermals): 64,122 64,113 104,113 104,117 110,117 110,122
VDD
  Top 0.203: IC1.5 128.27,72.28 128.07,72.07 128.07,70.48 128.27,70.28 IC1.1 130.34,70.28 130.45,70.17 130.45,68.1 C4.1
  Top 0.61: C4.1 130.29,66.09 L1.1 C8.1
VIN
  Top 0.203: R30.2 160.59,57.78 IN.1
  Top 2.54: IN.1 162.56,58.26 T1.C
VSS  (via drill 0.35)
  Top 0.203: IC18.7 137.89,51.46 139.38,49.96 139.38,49.37 139.7,49.05 168.59,49.05 171.93,52.39 171.93,63.18 170.5,64.61 R4.2 | IC18.3 141.88,50.96 v142.35,50.48 141.83,49.96 IC18.1 | IC1.4 130.74,71.78 v130.77,71.75 | IC5.TP v121.04,108.1 v121.03,108.11 | R10.1 118.44,98.54 | IN.2 162.29,51.96 IC18.5 | RST-ESP.1 125.47,93.14 C19.2
  Top 0.406: IC7.6 70.91,84.93 v70.94,84.97 | 63.8,79.11 IC7.39 63.82,77.97 v63.96,77.82 | IC7.28 56.86,84.93 v56.74,84.81 | IC7.18 63.02,91.94 v62.93,92.03
  Top 0.61: v144.1,65.72 IC3.11 | IC2.1 103.84,97.95 v103.89,97.91 | IC10.1 84.47,97.95 v84.52,97.91
  Top 0.813: C48.1 v147.59,66.67 146.05,66.67 R32.1 | v139.97,59.21 139.97,58.05 R35.2 | v139.02,55.24 C47.2 | v131.88,67.94 C2.2 | v132.35,60.8 132.35,59.42 R40.2 | v131.08,56.83 C51.2 | C4.2 v127.11,67.94 C5.2 | v125.53,63.34 C8.2 | v134.74,47.31 C9.2 | v134.74,44.77 C21.2 | C29.2 91.34,101.01 v91.34,99.02 92.13,99.02 C28.2 | C11.1 105.63,111.4 v105.63,113.3 105.86,113.3 C10.1 | 111.37,102.67 IC5.9 111.35,102.58 v111.35,101.56 | IC5.18 128.48,114.57 v126.9,114.57 | IC5.13 v126.9,107.11 | v105.16,105.21 C26.2 | v119.28,98.58 118.06,98.58 R10.1 | v107.38,85.41 C30.2 | v107.38,74.45 C31.2 | C12.2 101.42,77.82 v101.42,79.01 | IC6.1 99.19,84.57 v100.63,84.57 | v100.95,87.59 102.21,87.59 C13.2 | C7.2 v84.77,36.35 v84.77,35.4 C6.2 | v63.48,96.4 63.48,95.31 C33.2 | v85.71,105.05 85.71,103.84 C16.2 | C15.1 80.63,90.31 v80.63,88.38 80.63,86.54 C14.1 | v63.64,73.14 63.64,74.28 C34.2 | v53.48,83.94 53.48,85.07 C1.2 | C20.2 71.98,101.64 v74.28,101.64 74.28,100.82 C17.2 | C32.2 v81.74,83.82
  Top 2.54: R4.2 IN.2
  other vias: 122.3,106.84 119.76,106.84 119.76,109.38 122.3,109.38 122.3,108.11 119.76,108.11 121.03,106.84 121.03,109.38
  pour Bottom (isolate 0.305, no thermals): 55,42 55,0 159,0 159,99 131,99 131,116 105,116 105,112 64,112 64,102 51,102 51,42
  pour Bottom (isolate 0.61, no thermals): 159,99 159,0 216,0 216,102 204,102 204,99
  pour Bottom (isolate 0.305, no thermals): 87,111.54 84.16,111.54 84.16,113.52 87,113.52
VUSB_ESP
  Top 0.61: IC2.16 95.2,97.95 C28.1 94.72,101.12
  Top 0.813: ESP.+5V 94.56,112.92 C29.1 94.72,101.12

### Text on the board
tNames: VSS | RST | MOSI | SCK | NC | MISO | VSS | LCD_RS | LCD_DB1 | LCD_DB3 | LCD_DB5 | LCD_DB7 | ENC_B | VSS | VSS | VSS | +5V | LCD_E | LCD_DB0 | LCD_DB2 | LCD_DB4 | LCD_DB6 | ENC_A | ENC_BTN | VSS | VSS | V+ | V- | - | + | 630 mA/T | DummyLoad R1.2 / azzurro@ne-mail.net